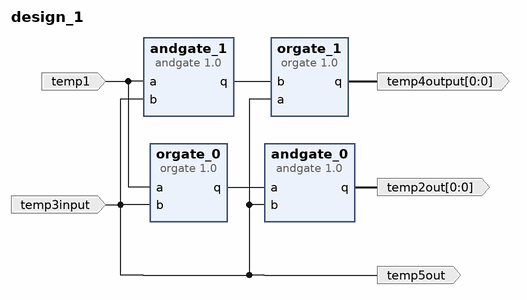
[diagram p0: block diagram of the top level]
# Vivado block design design_1, xc7a100tfgg484-1, Vivado 2017.4
create_bd_design design_1

create_bd_port -dir I temp1
create_bd_port -dir O -from 0 -to 0 temp2out
create_bd_port -dir I temp3input
create_bd_port -dir O temp5out
create_bd_port -dir O -from 0 -to 0 temp4output

create_bd_cell -type ip -vlnv SUSTC:CSE:orgate:1.0 orgate_0
create_bd_cell -type ip -vlnv SUSTC:CSE:andgate:1.0 andgate_0
create_bd_cell -type ip -vlnv SUSTC:CSE:andgate:1.0 andgate_1
create_bd_cell -type ip -vlnv SUSTC:CSE:orgate:1.0 orgate_1

# ---- connections ----

connect_bd_net [get_bd_pins orgate_0/q] [get_bd_pins andgate_0/a]
connect_bd_net [get_bd_pins andgate_0/q] [get_bd_ports temp2out]
connect_bd_net [get_bd_ports temp3input] \
  [get_bd_pins orgate_0/b] [get_bd_pins andgate_1/b] [get_bd_pins orgate_1/a] [get_bd_ports temp5out] \
  [get_bd_pins andgate_0/b]
connect_bd_net [get_bd_pins andgate_1/q] [get_bd_pins orgate_1/b]
connect_bd_net [get_bd_pins orgate_1/q] [get_bd_ports temp4output]
connect_bd_net -net temp1_1 [get_bd_ports temp1] [get_bd_pins orgate_0/a] [get_bd_pins andgate_1/a]

validate_bd_design
save_bd_design
